# EAGLE design dawa_v4.0 (EAGLE 7.4.0)
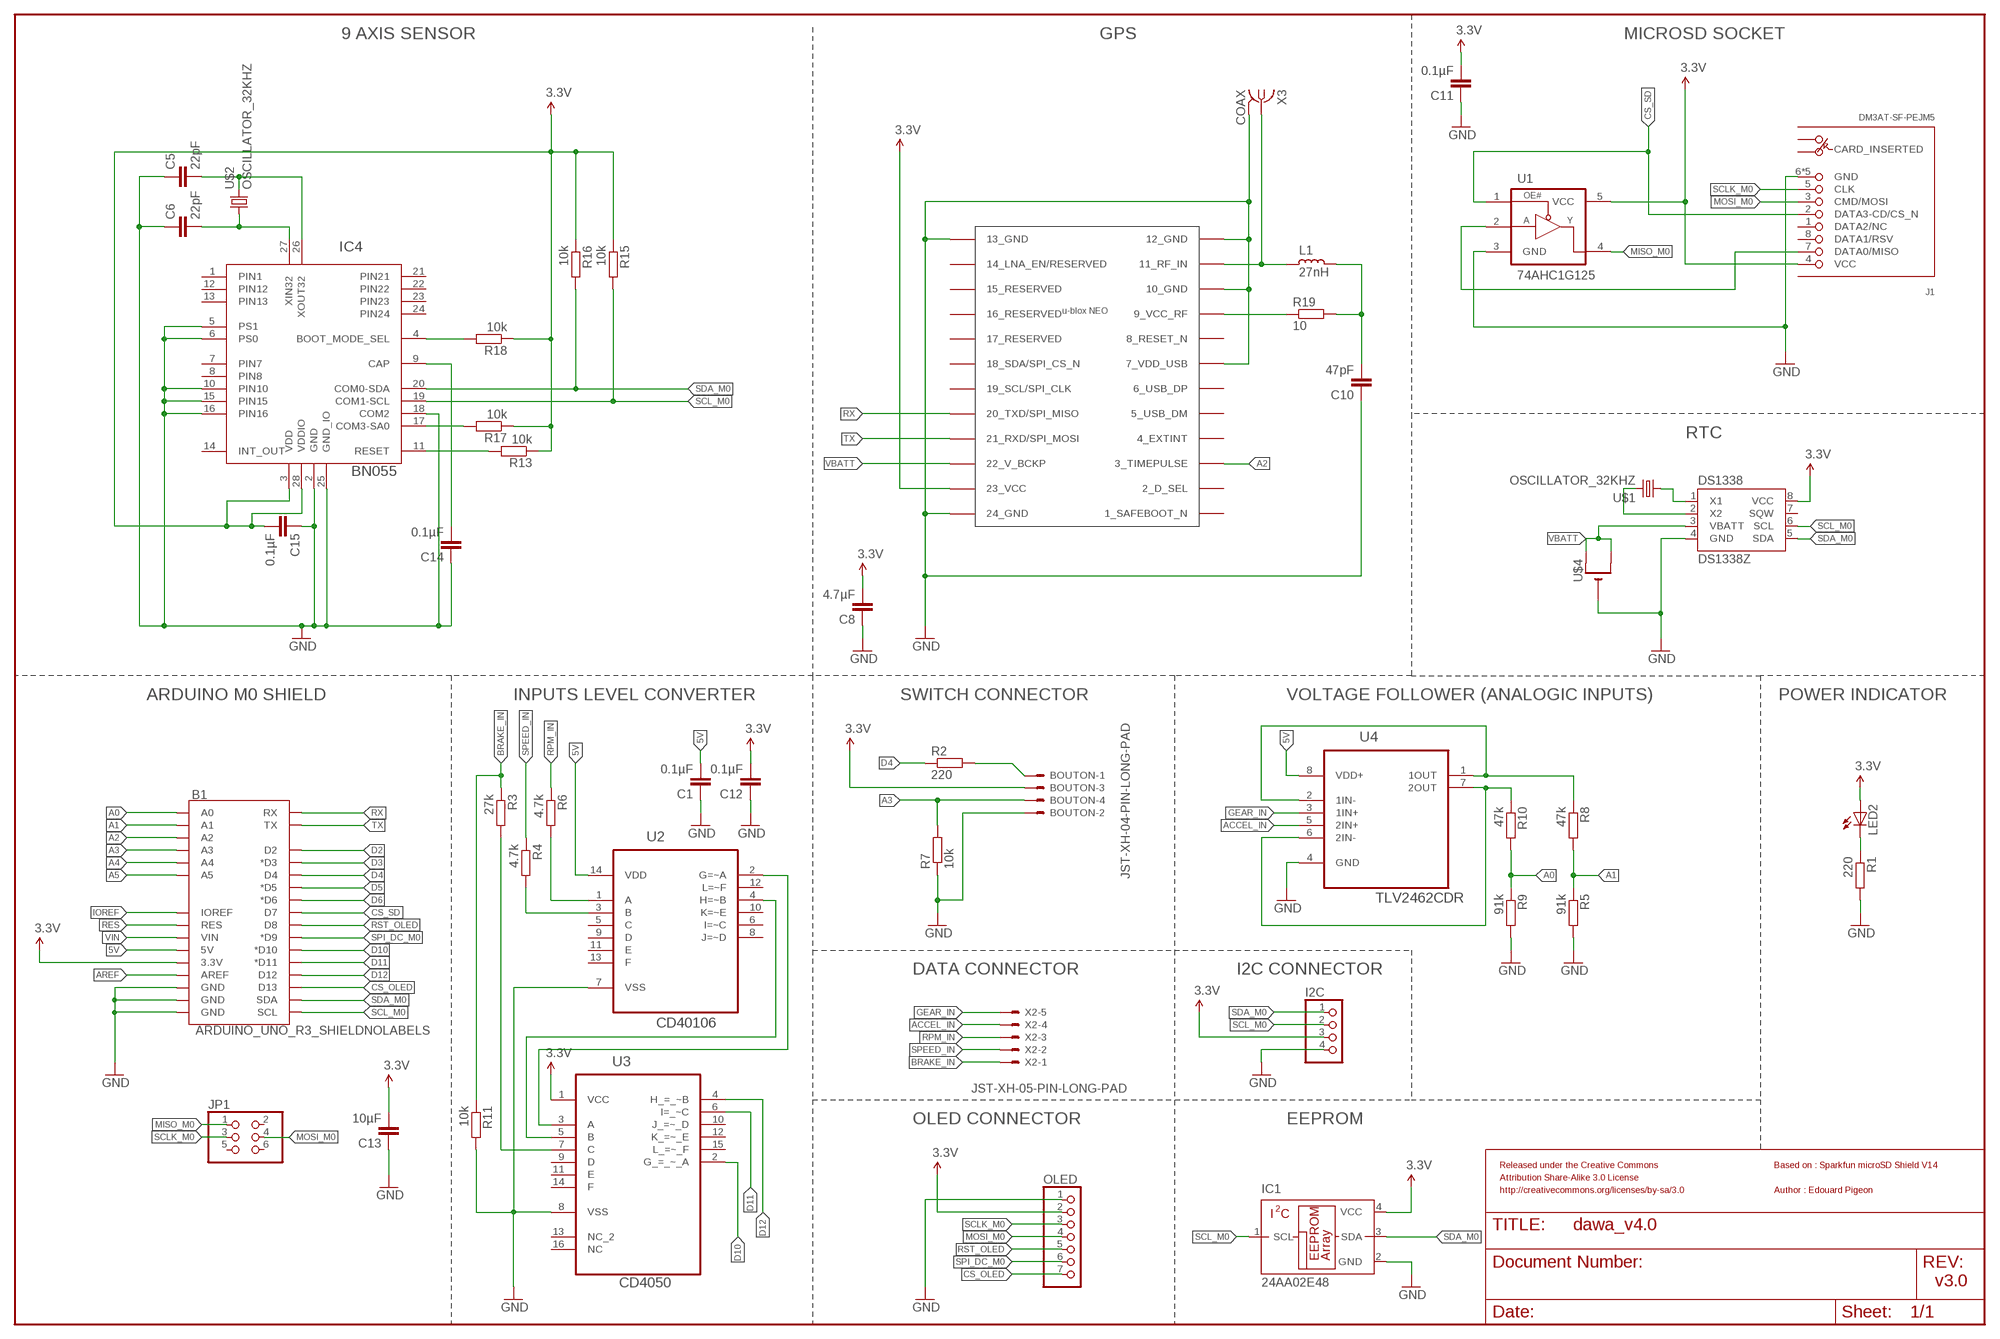
[diagram p0: schematic, sheet 1]

## Parts
B1  ARDUINO_UNO_R3_SHIELDNOLABELS  [UNO_R3_SHIELD_NOLABELS]
BOUTON  JST-XH-04-PIN-LONG-PAD  [JST-XH-04-PACKAGE-LONG-PAD]
C1  0.1µF  C-EUC0603  [C0603]
C5  22pF  C-EUC0603  [C0603]
C6  22pF  C-EUC0603  [C0603]
C8  4.7µF  C-EUC0603  [C0603]
C10  47pF  C-EUC0603  [C0603]
C11  0.1µF  C-EUC0603  [C0603]
C12  0.1µF  C-EUC0603  [C0603]
C13  10µF  C-EUC0603  [C0603]
C14  0.1µF  C-EUC0603  [C0603]
C15  0.1µF  C-EUC0603  [C0603]
DS1338  DS1338Z  [SO08]
I2C  PINHD-1X4  [1X04]
IC1  24AA02E48  24AA00OT  [SOT23-5L]
IC4  BN055  1658_BNO055  [LGA-28_3.80X5.20/0.5]
J1  DM3AT-SF-PEJM5  [DM3AT-SF-PEJM5]
JP1  PINHD-2X3  [2X03]
L1  27nH  L_0603  [L0603]
LED2  LEDCHIPLED_1206  [CHIPLED_1206]
OLED  PINHD-1X7  [1X07]
R1  220  R-EU_R0603  [R0603]
R2  220  R-EU_R0603  [R0603]
R3  27k  R-EU_R0603  [R0603]
R4  4.7k  R-EU_R0603  [R0603]
R5  91k  R-EU_R0603  [R0603]
R6  4.7k  R-EU_R0603  [R0603]
R7  10k  R-EU_R0603  [R0603]
R8  47k  R-EU_R0603  [R0603]
R9  91k  R-EU_R0603  [R0603]
R10  47k  R-EU_R0603  [R0603]
R11  10k  R-EU_R0603  [R0603]
R13  10k  R-EU_R0603  [R0603]
R15  10k  R-EU_R0603  [R0603]
R16  10k  R-EU_R0603  [R0603]
R17  10k  R-EU_R0603  [R0603]
R18  10k  R-EU_R0603  [R0603]
R19  10  R-EU_M1206  [M1206]
U1  74AHC1G125  74AHC1G125DBV  [SOT23-5]
U2  CD40106  CD40106BPW  [SOP65P640X120-14N]
U3  CD4050  CD4049UBPW  [SOP65P640X120-16N]
U4  TLV2462CDR  [SOIC127P600X175-8N]
U$1  OSCILLATOR_32KHZ  [OSCILLATOR_SMD]
U$2  OSCILLATOR_32KHZ  [OSCILLATOR_SMD]
U$3  NEO-M8  [NEO-M8]
U$4  CR1220SMT  [CR1220-SMD]
X2  JST-XH-05-PIN-LONG-PAD  [JST-XH-05-PACKAGE-LONG-PAD]
X3  COAX  [MMCX-J-P-X-ST-EM1-MKT]

## Nets
3.3V: B1.3.3V BOUTON.3 C8.2 C11.2 C12.2 C13.2 C15.2 DS1338.8(VCC) I2C.3 IC1.4(VCC) IC4.3(VDD) IC4.28(VDDIO) J1.4(VCC) LED2.A OLED.2 R13.1 R15.1 R16.1 R17.1 R18.1 U1.5(VCC) U3.1(VCC) U$3.23(23_VCC)
5V: B1.5V C1.2 U2.14(VDD) U4.8(VDD+)
A0: B1.A0 R9.1 R10.2
A1: B1.A1 R5.1 R8.2
A2: B1.A2 U$3.3(3_TIMEPULSE)
A3: B1.A3 BOUTON.4 R7.2
A4: B1.A4
A5: B1.A5
ACCEL_IN: U4.5(2IN+) X2.4
AREF: B1.AREF
BRAKE_IN: R3.1 R11.1 X2.1
CS_OLED: B1.D13 OLED.7
CS_SD: B1.D7 J1.2(DATA3-CD/CS_N) U1.1(OE#)
D2: B1.D2
D3: B1.D3(*D3)
D4: B1.D4 R2.1
D5: B1.D5(*D5)
D6: B1.D6(*D6)
D10: B1.D10(*D10) U3.2(G_=_~_A)
D11: B1.D11(*D11) U3.6(I=_~C)
D12: B1.D12 U3.4(H_=_~B)
GEAR_IN: U4.3(1IN+) X2.5
GND: B1.GND@0(GND) B1.GND@1(GND) B1.GND@2(GND) BOUTON.2 C1.1 C5.1 C6.1 C8.1 C10.1 C11.1 C12.1 C13.1 C14.1 C15.1 DS1338.4(GND) I2C.4 IC1.2(GND) IC4.2(GND) IC4.5(PS1) IC4.6(PS0) IC4.10(PIN10) IC4.15(PIN15) IC4.16(PIN16) IC4.18(COM2) IC4.25(GND_IO) J1.6(GND) J1.MOUNT0(GND) J1.MOUNT1(GND) J1.MOUNT2(GND) J1.MOUNT3(GND) OLED.1 R1.2 R5.2 R7.1 R9.2 R11.2 U1.3(GND) U2.7(VSS) U3.8(VSS) U4.4(GND) U$3.7(7_VDD_USB) U$3.10(10_GND) U$3.12(12_GND) U$3.13(13_GND) U$3.24(24_GND) U$4.- X3.2@1(GND)
IOREF: B1.IOREF
MISO_M0: JP1.1 U1.4(Y)
MOSI_M0: J1.3(CMD/MOSI) JP1.4 OLED.4
N$1: BOUTON.1 R2.2
N$2: R6.2 U2.1(A)
N$3: U2.2(G=~A) U3.3(A)
N$4: R4.2 U2.3(B)
N$5: R3.2 U3.7(C)
N$6: LED2.C R1.1
N$7: IC4.11(RESET) R13.2
N$8: DS1338.2(X2) U$1.2
N$9: DS1338.1(X1) U$1.1
N$10: J1.7(DATA0/MISO) U1.2(A)
N$11: C10.2 L1.1 R19.2
N$12: R8.1 U4.1(1OUT) U4.2(1IN-)
N$13: C14.2 IC4.9(CAP)
N$14: IC4.4(BOOT_MODE_SEL) R18.2
N$15: C5.2 IC4.26(XOUT32) U$2.2
N$16: C6.2 IC4.27(XIN32) U$2.1
N$17: IC4.17(COM3-SA0) R17.2
N$18: R10.1 U4.6(2IN-) U4.7(2OUT)
N$19: R19.1 U$3.9(9_VCC_RF)
N$20: L1.2 U$3.11(11_RF_IN) X3.1
N$21: U2.4(H=~B) U3.5(B)
RES: B1.RES
RPM_IN: R6.1 X2.3
RST_OLED: B1.D8 OLED.5
RX: B1.RX U$3.20(20_TXD/SPI_MISO)
SCL_M0: B1.SCL DS1338.6(SCL) I2C.2 IC1.1(SCL) IC4.19(COM1-SCL) R15.2
SCLK_M0: J1.5(CLK) JP1.3 OLED.3
SDA_M0: B1.SDA DS1338.5(SDA) I2C.1 IC1.3(SDA) IC4.20(COM0-SDA) R16.2
SPEED_IN: R4.1 X2.2
SPI_DC_M0: B1.D9(*D9) OLED.6
TX: B1.TX U$3.21(21_RXD/SPI_MOSI)
VBATT: DS1338.3(VBATT) U$3.22(22_V_BCKP) U$4.+$1(+) U$4.+$2(+1)
VIN: B1.VIN
Unconnected: DS1338.7(SQW) IC4.1(PIN1) IC4.7(PIN7) IC4.8(PIN8) IC4.12(PIN12) IC4.13(PIN13) IC4.14(INT_OUT) IC4.21(PIN21) IC4.22(PIN22) IC4.23(PIN23) IC4.24(PIN24) J1.1(DATA2/NC) J1.8(DATA1/RSV) J1.A J1.B JP1.2 JP1.5 JP1.6 U2.5(C) U2.6(I=~C) U2.8(J=~D) U2.9(D) U2.10(K=~E) U2.11(E) U2.12(L=~F) U2.13(F) U3.9(D) U3.10(J_=~_D) U3.11(E) U3.12(K_=~_E) U3.13(NC_2) U3.14(F) U3.15(L_=~_F) U3.16(NC) U$3.1(1_SAFEBOOT_N) U$3.2(2_D_SEL) U$3.4(4_EXTINT) U$3.5(5_USB_DM) U$3.6(6_USB_DP) U$3.8(8_RESET_N) U$3.14(14_LNA_EN/RESERVED) U$3.15(15_RESERVED) U$3.16(16_RESERVED) U$3.17(17_RESERVED) U$3.18(18_SDA/SPI_CS_N) U$3.19(19_SCL/SPI_CLK)

## Notes on the sheet
- 9 AXIS SENSOR | GPS | MICROSD SOCKET
- RTC
- ARDUINO M0 SHIELD | POWER INDICATOR
- INPUTS LEVEL CONVERTER | SWITCH CONNECTOR | VOLTAGE FOLLOWER (ANALOGIC INPUTS)
- DATA CONNECTOR | I2C CONNECTOR
- OLED CONNECTOR | EEPROM
- Released under the Creative Commons | Based on : Sparkfun microSD Shield V14
- Attribution Share-Alike 3.0 License
- http://creativecommons.org/licenses/by-sa/3.0 | Author : Edouard Pigeon
- v3.0

## Power pins joined to a net without a drawn wire
GND: X3.2@2(GND) X3.2@3(GND) X3.2@4(GND)

## Library data of the parts
B1 = SparkFun-Boards-resize:ARDUINO_UNO_R3_SHIELD: Arduino R3 Shield Footprint Shield form compatible with the Arduino Uno R3. SparkFun Products: MG2639 Cellular Shield <https://www.sparkfun.com/products/13120> MIDI Shield <https://www.sparkfun.com/products/12898> R3 Stackable Headers Kit <https://www.sparkfun.com/products/11417>
BOUTON = Rembrandt Electronics - JST XH Connectors v1-0:JST-XH-04-PIN: JST XH Connector 2 Pin Wire to board connector. Pitch: 2,54 mm, (0.100") Number of pins: 4 Created by Rembrandt Electronics www.rembrandtelectronics.com
C1 C5 C6 C8 C10-C15 = rcl:C-EU: CAPACITOR, European symbol
DS1338 = maxim-ic:DS1338
I2C = pinhead:PINHD-1X4: PIN HEADER
IC1 = microchip:24*00: Serial EEPROM 128 bit, I2C (AA = 1.8 V/LC = 2.5 V/C = 5.0 V); MF: MICROCHIP; MPN: 24AA00T-I/OTG; OC_FARNELL: 1331264; OC_NEWARK: 89H3038
IC4 = BNO055-2:1658_BNO055: BN055 Intelligent 9-axis absolute orientation sensor; PART_NUMBER: BNO055
J1 = connector-hirose:DM3AT-SF-PEJM5: CONN MICRO SD R/A PUSH-PUSH SMD; DIGIKEY: HR1964CT-ND
JP1 = pinhead:PINHD-2X3: PIN HEADER
L1 = rc-master-smd:L_: INDUCTOR
LED2 = led:LED: LED OSRAM: - CHIPLED LG R971, LG N971, LY N971, LG Q971, LY Q971, LO R971, LY R971 LH N974, LH R974 LS Q976, LO Q976, LY Q976 LO Q996 - Hyper CHIPLED LW Q18S LB Q993, LB Q99A, LB R99A - SideLED LS A670, LO A670, LY A670, LG A670, LP A670 LB A673, LV A673, LT A673, LW A673 LH A674 LY A675 LS A676, LA A676, LO A676, LY A676, LW A676 LS A679, LY A679, LG A679 - Hyper Micro SIDELED® LS Y876, LA Y876, LO Y876, LY Y876 LT Y87S - SmartLED LW L88C, LW L88S LB L89C, LB L89S, LG L890 LS L89K, LO L89K, LY L89K LS L896, LA L896, LO L896, LY L896 - TOPLED LS T670, LO T670, LY T670, LG T670, LP T670 LSG T670, LSP T670, LSY T670, LOP T670, LYG T670 LG T671, LOG T671, LSG T671 LB T673, LV T673, LT T673, LW T673 LH T674 LS T676, LA T676, LO T676, LY T676, LB T676, LH T676, LSB T676, LW T676 LB T67C, LV T67C, LT T67C, LS T67K, LO T67K, LY T67K, LW E67C LS E67B, LA E67B, LO E67B, LY E67B, LB E67C, LV E67C, LT E67C LW T67C LS T679, LY T679, LG T679 LS T770, LO T770, LY T770, LG T770, LP T770 LB T773, LV T773, LT T773, LW T773 LH T774 LS E675, LA E675, LY E675, LS T675 LS T776, LA T776, LO T776, LY T776, LB T776 LHGB T686 LT T68C, LB T68C - Hyper Mini TOPLED® LB M676 - Mini TOPLED Santana® LG M470 LS M47K, LO M47K, LY M47K Source: http://www.osram.convergy.de LUXEON: - LUMILED® LXK2-PW12-R00, LXK2-PW12-S00, LXK2-PW14-U00, LXK2-PW14-V00 LXK2-PM12-R00, LXK2-PM12-S00, LXK2-PM14-U00 LXK2-PE12-Q00, LXK2-PE12-R00, LXK2-PE12-S00, LXK2-PE14-T00, LXK2-PE14-U00 LXK2-PB12-K00, LXK2-PB12-L00, LXK2-PB12-M00, LXK2-PB14-N00, LXK2-PB14-P00, LXK2-PB14-Q00 LXK2-PR12-L00, LXK2-PR12-M00, LXK2-PR14-Q00, LXK2-PR14-R00 LXK2-PD12-Q00, LXK2-PD12-R00, LXK2-PD12-S00 LXK2-PH12-R00, LXK2-PH12-S00 LXK2-PL12-P00, LXK2-PL12-Q00, LXK2-PL12-R00 Source: www.luxeon.com KINGBRIGHT: KA-3528ASYC Source: www.kingbright.com
OLED = pinhead:PINHD-1X7: PIN HEADER
R1-R11 R13 R15-R19 = resistor:R-EU_: RESISTOR, European symbol
U1 = 74ah:74AHC1G125: TRI-STATE SINGLE BUSS BUFFER
U2 = TI:CD40106BPW: QUADRUPLE FET BUS SWITCH 2.5-V/3.3-V LOW-VOLTAGE BUS SWITCH WITH 5-V-TOLERANT LEVEL SHIFTER; MPN: CD40106BPW; OC_FARNELL: 1741145; OC_NEWARK: 34R6794; PACKAGE: TSSOP-14; SUPPLIER: Texas Instruments
U3 = TI:CD4049UBPW: CMOS Hex Buffer/Converters; MPN: CD4049UBPW; OC_FARNELL: 1740863; OC_NEWARK: 50R5061; PACKAGE: TSSOP-16; SUPPLIER: Texas Instruments
U4 = TI:TLV2462CDR: OPERATIONAL AMPLIFIERS; MPN: TLV2462CDR; OC_FARNELL: 1535737; OC_NEWARK: 73C9479; PACKAGE: SOIC-8; SUPPLIER: Texas Instruments
U$1 U$2 = kanflo:OSCILLATOR_32KHZ: CM7V-T1A Tuning Fork Crystal 32.768 kHz
U$3 = ubloxLib:NEO-M8: u-blox NEO GNSS module
U$4 = adafruit:CR1220: CR1216/CR1220/CR1225 12mm 3V lithium coin cell Great for battery packup. Both SMT and THM holders. Note the THM package has the ground pads on both sides of the PCB so that the masks are the same - this reduces the cost
X2 = Rembrandt Electronics - JST XH Connectors v1-0:JST-XH-05-PIN: JST XH Connector 2 Pin Wire to board connector. Pitch: 2,54 mm, (0.100") Number of pins: 5 Created by Rembrandt Electronics www.rembrandtelectronics.com
X3 = con-samtec:COAX: MMCX STRAIGHT, EDGE MOUNT JACK- 50 OHM Source: http://www.samtec.com/ftppub/cpdf/MMCX-J-P-X-ST-EM1-MKT.pdf; OC_FARNELL: unknown; OC_NEWARK: unknown

## Board
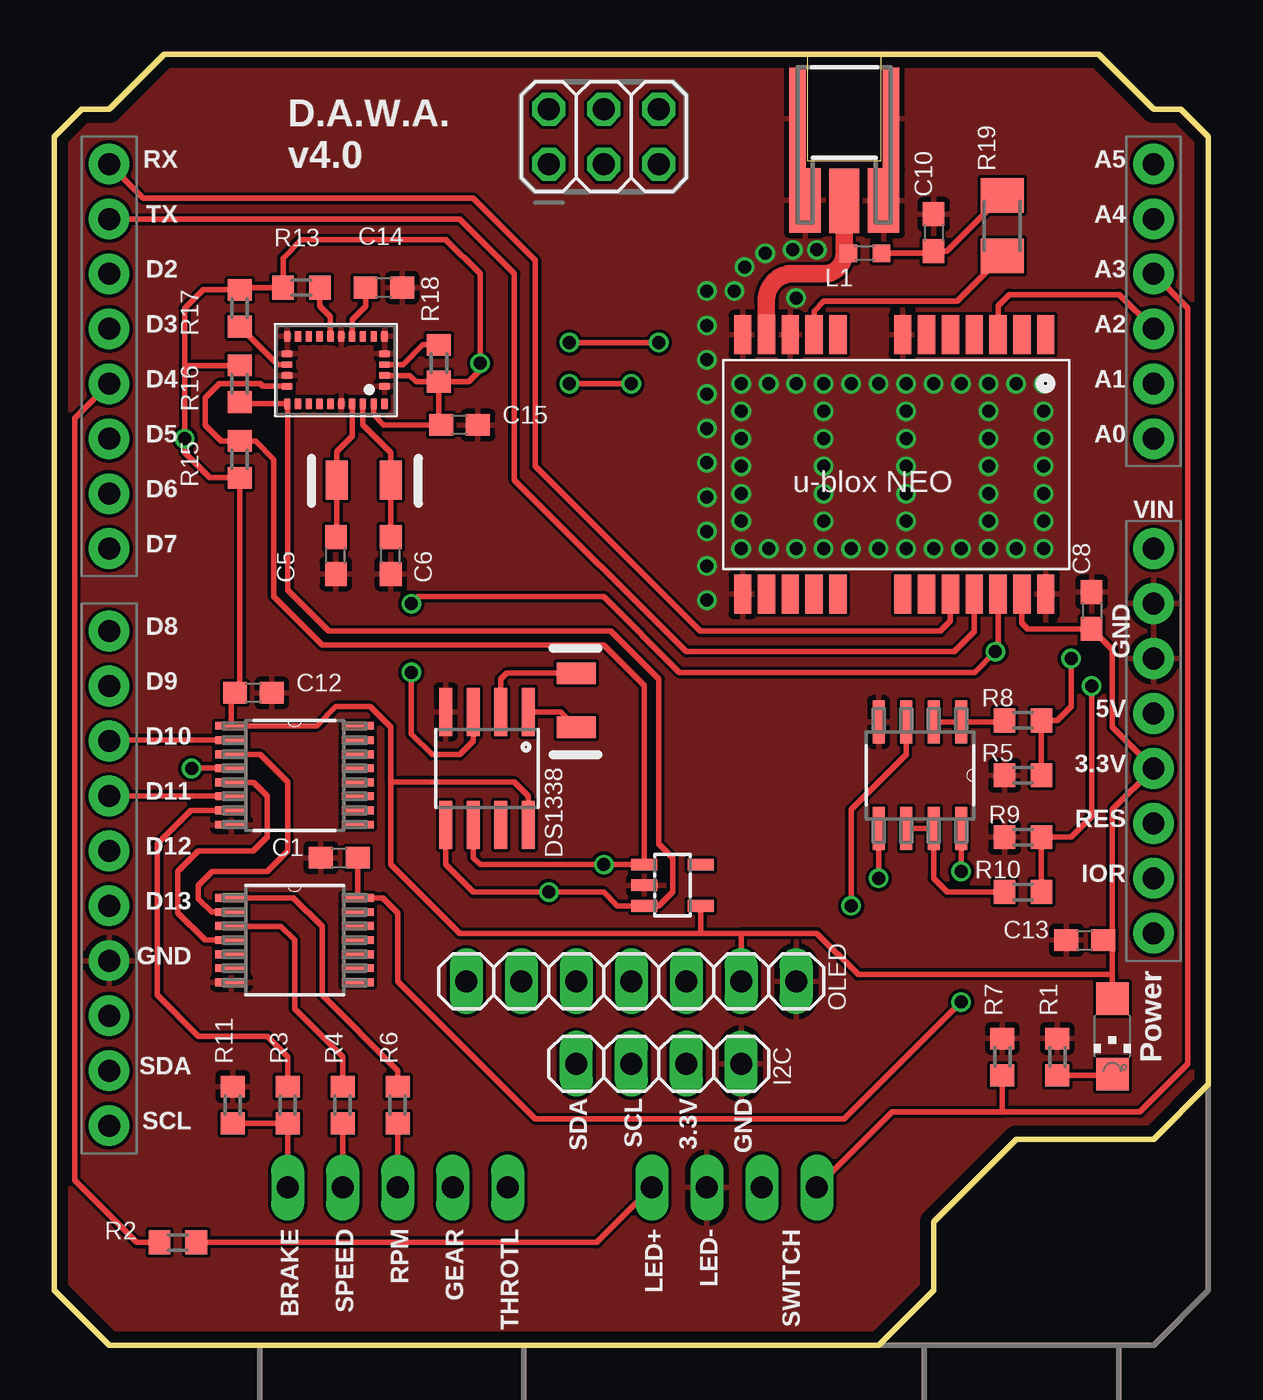
[diagram p1: board, top side]
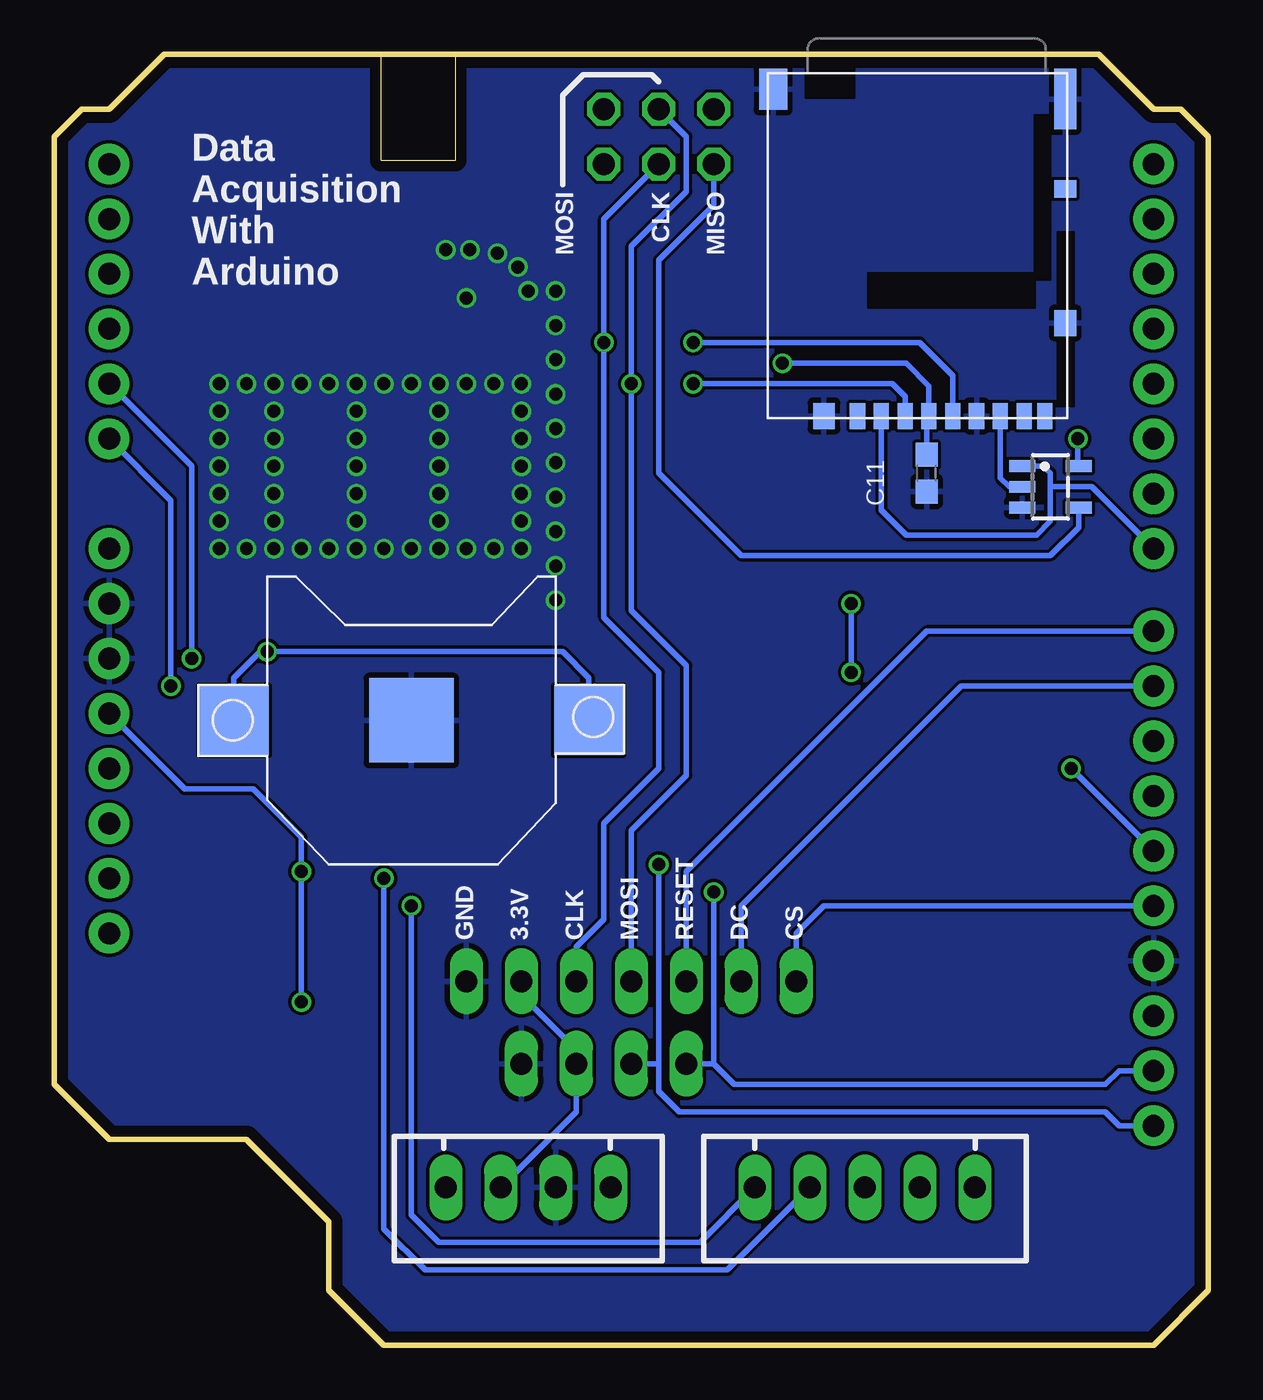
[diagram p2: board, bottom side, seen from below]

Size 53.34 x 59.69 mm. Coordinates in mm from the lower left corner, seen from the top.
Outline: 0,2.54 0,55.88 1.27,57.15 2.54,57.15 5.08,59.69 48.26,59.69 50.8,57.15 52.07,57.15 53.34,55.88 53.34,12.06 50.8,9.53 44.45,9.53 40.64,5.71 40.64,2.54 38.1,0 2.54,0 0,2.54
Copper layers (1*16): Top 0.035mm / dielectric 1.6mm / Bottom 0.035mm
Design rules "Elecrow_2-layer_PCB_eagle_rule": minimum track width 6mil, minimum drill 12mil, track to track 6mil, track to pad 6mil, pad to pad 6mil, via to via 8mil, smd to smd 0mil, copper to edge 20mil, drill to drill 10mil, minimum pad ring 6mil, minimum via ring 6mil, stop-mask expansion 0mil, vias tented up to drill 100mil, thermal gap 10mil

### Footprints (pad centres in the part's own frame; a part is rotated, then mirrored left to right if it is on the bottom)
UNO_R3_SHIELD_NOLABELS = drill 1.016 pad 1.88: 3.3V 24.13,-3.81; 5V 24.13,-1.27; A0 24.13,11.43; A1 24.13,13.97; A2 24.13,16.51; A3 24.13,19.05; A4 24.13,21.59; A5 24.13,24.13; AREF -24.13,-15.24; D2 -24.13,19.05; D3 -24.13,16.51; D4 -24.13,13.97; D5 -24.13,11.43; D6 -24.13,8.89; D7 -24.13,6.35; D8 -24.13,2.54; D9 -24.13,0; D10 -24.13,-2.54; D11 -24.13,-5.08; D12 -24.13,-7.62; D13 -24.13,-10.16; GND@0 24.13,1.27; GND@1 24.13,3.81; GND@2 -24.13,-12.7; IOREF 24.13,-8.89; NC 24.13,-11.43; RES 24.13,-6.35; RX -24.13,24.13; SCL -24.13,-20.32; SDA -24.13,-17.78; TX -24.13,21.59; VIN 24.13,6.35
JST-XH-04-PACKAGE-LONG-PAD = drill 1.016 long: 1 -3.81,0; 2 -1.27,0; 3 1.27,0; 4 3.81,0
C0603 = smd 1.1 x 1: 1 -0.85,0; 2 0.85,0
SO08 = smd 0.61 x 2.21: 1 -1.905,-2.616; 2 -0.635,-2.616; 3 0.635,-2.616; 4 1.905,-2.616; 5 1.905,2.616; 6 0.635,2.616; 7 -0.635,2.616; 8 -1.905,2.616
1X04 = drill 1.016 long: 1 -3.81,0; 2 -1.27,0; 3 1.27,0; 4 3.81,0
SOT23-5L = smd 0.55 x 1.2: 1 -0.95,-1.3; 2 0,-1.3; 3 0.95,-1.3; 4 0.95,1.3; 5 -0.95,1.3
LGA-28_3.80X5.20/0.5 = smd 0.3 x 0.5: 1 -2.25,1.56; 6 -2.25,-1.56; 7 -1.75,-1.56; 8 -1.25,-1.56; 9 -0.75,-1.56; 10 -0.25,-1.56; 11 0.25,-1.56; 12 0.75,-1.56; 13 1.25,-1.56; 14 1.75,-1.56; 15 2.25,-1.56; 20 2.25,1.56; 21 1.75,1.56; 22 1.25,1.56; 23 0.75,1.56; 24 0.25,1.56; 25 -0.25,1.56; 26 -0.75,1.56; 27 -1.25,1.56; 28 -1.75,1.56 | smd 0.5 x 0.3: 2 -2.25,0.75; 3 -2.25,0.25; 4 -2.25,-0.25; 5 -2.25,-0.75; 16 2.25,-0.75; 17 2.25,-0.25; 18 2.25,0.25; 19 2.25,0.75
DM3AT-SF-PEJM5 = smd 0.7 x 1.2: 1 3.2,-0.1; 2 2.1,-0.1; 3 1,-0.1; 4 -0.1,-0.1; 5 -1.2,-0.1; 6 -2.3,-0.1; 7 -3.4,-0.1; 8 -4.5,-0.1; B -5.45,-0.1 | smd 1 x 0.8: A -6.4,-10.6 | smd 1 x 1.2: MOUNT0 4.75,-0.1; MOUNT1 -6.4,-4.4 | smd 1 x 2.8: MOUNT2 -6.4,-14.75 | smd 1.3 x 1.9: MOUNT3 7.1,-15.2
2X03 = drill 1.016 octagon: 1 -2.54,-1.27; 2 -2.54,1.27; 3 0,-1.27; 4 0,1.27; 5 2.54,-1.27; 6 2.54,1.27
L0603 = smd 0.8 x 0.8: 1 -0.762,0; 2 0.762,0
CHIPLED_1206 = smd 1.5 x 1.5: A 0,-1.75; C 0,1.75
1X07 = drill 1.016 long: 1 -7.62,0; 2 -5.08,0; 3 -2.54,0; 4 0,0; 5 2.54,0; 6 5.08,0; 7 7.62,0
R0603 = smd 1 x 1.1: 1 -0.85,0; 2 0.85,0
M1206 = smd 1.6 x 2: 1 -1.4,0; 2 1.4,0
SOT23-5 = smd 0.55 x 1.2: 1 -0.95,-1.3; 2 0,-1.3; 3 0.95,-1.3; 4 0.95,1.3; 5 -0.95,1.3
SOP65P640X120-14N = smd 1.473 x 0.356: 1 -2.921,1.956; 2 -2.921,1.295; 3 -2.921,0.66; 4 -2.921,0; 5 -2.921,-0.66; 6 -2.921,-1.295; 7 -2.921,-1.956; 8 2.921,-1.956; 9 2.921,-1.295; 10 2.921,-0.66; 11 2.921,0; 12 2.921,0.66; 13 2.921,1.295; 14 2.921,1.956
SOP65P640X120-16N = smd 1.473 x 0.356: 1 -2.921,2.286; 2 -2.921,1.626; 3 -2.921,0.965; 4 -2.921,0.33; 5 -2.921,-0.33; 6 -2.921,-0.965; 7 -2.921,-1.626; 8 -2.921,-2.286; 9 2.921,-2.286; 10 2.921,-1.626; 11 2.921,-0.965; 12 2.921,-0.33; 13 2.921,0.33; 14 2.921,0.965; 15 2.921,1.626; 16 2.921,2.286
SOIC127P600X175-8N = smd 1.981 x 0.559: 1 -2.464,1.905; 2 -2.464,0.635; 3 -2.464,-0.635; 4 -2.464,-1.905; 5 2.464,-1.905; 6 2.464,-0.635; 7 2.464,0.635; 8 2.464,1.905
OSCILLATOR_SMD = smd 1 x 1.8: 1 0,0; 2 2.5,0
NEO-M8 = smd 1.8 x 0.8: 1 6.4,-7.4; 2 6.4,-6.3; 3 6.4,-5.2; 4 6.4,-4.1; 5 6.4,-3; 6 6.4,-1.9; 7 6.4,-0.8; 8 6.4,2.2; 9 6.4,3.3; 10 6.4,4.4; 11 6.4,5.5; 12 6.4,6.6; 13 -5.6,6.6; 14 -5.6,5.5; 15 -5.6,4.4; 16 -5.6,3.3; 17 -5.6,2.2; 18 -5.6,-0.8; 19 -5.6,-1.9; 20 -5.6,-3; 21 -5.6,-4.1; 22 -5.6,-5.2; 23 -5.6,-6.3; 24 -5.6,-7.4
CR1220-SMD = smd 3.2 x 3.2: +$1 -8.2,0; +$2 8.2,0 | smd 3.9 x 3.9: - 0,0
JST-XH-05-PACKAGE-LONG-PAD = drill 1.016 long: 1 -5.08,0; 2 -2.54,0; 3 0,0; 4 2.54,0; 5 5.08,0
MMCX-J-P-X-ST-EM1-MKT = smd 1.4 x 2.975: 1 0,-6.15 | smd 1.46 x 2.975: 2@1 -1.812,-6.125; 2@2 1.812,-6.138 | smd 0.76 x 4.7: 2@3 -2.163,-2.35; 2@4 2.163,-2.35

### Placement (x,y rotation side)
B1  26.67,30.48 0 top
BOUTON  31.43,7.3 180 bottom
C1  13.18,22.54 0 top
C5  13.02,36.51 90 top
C6  15.56,36.51 90 top
C8  47.94,33.97 270 top
C10  40.64,51.44 270 top
C11  13.02,40.32 90 bottom
C12  9.21,30.16 180 top
C13  47.62,18.73 0 top
C14  15.24,48.9 180 top
C15  18.73,42.55 180 top
DS1338  20,26.67 180 top
I2C  27.94,13.02 0 top
IC1  28.57,21.27 270 top
IC4  13.02,45.09 180 top
J1  13.02,42.86 180 bottom
JP1  25.4,55.88 0 top
L1  37.47,50.48 180 top
LED2  48.9,14.29 180 top
OLED  26.67,16.83 180 top
R1  46.36,13.34 90 top
R2  5.71,4.76 0 top
R3  10.79,11.11 90 top
R4  13.33,11.11 90 top
R5  44.77,26.35 180 top
R6  15.88,11.11 90 top
R7  43.82,13.34 270 top
R8  44.77,28.89 0 top
R9  44.77,23.5 180 top
R10  44.77,20.95 0 top
R11  8.26,11.11 90 top
R13  11.43,48.9 0 top
R15  8.57,40.96 90 top
R16  8.57,44.45 270 top
R17  8.57,47.94 270 top
R18  17.78,45.4 90 top
R19  43.82,51.75 90 top
U1  7.3,39.69 270 bottom
U2  11.11,18.73 0 top
U3  11.11,26.35 0 top
U4  40.01,26.35 270 top
U$1  24.13,28.57 90 top
U$2  15.56,40.01 180 top
U$3  38.42,40.32 90 top
U$4  36.83,28.89 0 bottom
X2  15.88,7.3 180 bottom
X3  36.51,59.05 0 top

### Tracks (layer width: path | path; a pad name or v marks a point on that pad's centre or on a via)
3.3V  (via drill 0.6)
  Top 0.254: 48.9,17.14 48.9,18.73 | 48.9,18.73 48.9,24.77 B1.3.3V 48.9,28.57 48.9,32.17 C8.2 44.98,33.12 44.72,33.39 U$3.23 | DS1338.8 21.91,25.4 21.27,26.04 15.56,26.04 | 15.56,26.04 15.56,22.23 18.73,19.05 29.84,19.05 | 29.84,19.05 31.75,19.05 | 15.56,26.04 15.56,28.57 14.61,29.53 13.02,29.53 12.13,28.64 U3.1 8.19,30 C12.2 8.57,30.38 R15.1 7.2,40.11 6.03,41.27 v6.03,41.91 6.03,45.3 | OLED.2 31.75,19.05 | IC1.4 29.88,19.08 29.84,19.05 | 6.03,45.3 6.03,47.94 6.88,48.79 R17.1 8.99,48.9 R13.1 10.58,50.27 11.43,51.12 18.1,51.12 19.68,49.53 v19.68,45.4 19.68,45.09 19.15,44.55 R18.1 | R16.1 6.03,45.3 | IC4.3 16.44,44.84 16.73,44.55 R18.1 | IC4.28 14.77,43.02 15.24,42.55 C15.2 17.78,42.65 R18.1 | LED2.A 48.9,17.14 | 48.9,17.14 37.15,17.14 35.24,19.05 31.75,19.05 | C13.2 48.9,18.73
  Bottom 0.254: v19.68,45.4 13.97,45.4 12.92,44.35 J1.4 13.02,42.86 C11.2 | OLED.2 31.75,16.19 29.21,13.65 I2C.3 29.21,10.79 BOUTON.3 | U1.5 6.03,40.67 v6.03,41.91
5V  (via drill 0.6)
  Top 0.254: v41.91,15.88 36.51,10.48 22.22,10.48 15.88,16.83 15.88,20 15.19,20.69 U2.14 C1.2 | U4.8 v41.91,21.91
  Bottom 0.254: v41.91,15.88 v41.91,21.91 41.91,23.5 44.13,25.72 47.31,25.72 B1.5V
A0  (via drill 0.6)
  Top 0.254: R10.2 R9.1 46.99,23.5 47.94,24.45 v47.94,30.48
  Bottom 0.254: v47.94,30.48 47.94,39.05 B1.A0
A1  (via drill 0.6)
  Top 0.254: R5.1 R8.2 46.36,28.89 46.99,29.53 v46.99,31.75
  Bottom 0.254: v46.99,31.75 46.99,40.64 B1.A1
A2
  Top 0.254: U$3.3 43.62,48.06 44.13,48.58 49.21,48.58 B1.A2
A3
  Top 0.254: 43.82,10.79 50.17,10.79 52.39,13.02 52.39,47.94 B1.A3 | R7.2 43.82,10.79 | 43.82,10.79 38.74,10.79 BOUTON.4
ACCEL_IN  (via drill 0.6)
  Top 0.254: U4.5 v38.1,21.59
  Bottom 0.254: v38.1,21.59 38.1,5.4 36.2,3.49 22.22,3.49 X2.4
BRAKE_IN
  Top 0.254: X2.1 R3.1 R11.1
CS_OLED
  Bottom 0.254: OLED.7 19.05,19.05 17.78,20.32 B1.D13
CS_SD
  Bottom 0.254: 7.3,39.69 5.4,39.69 B1.D7 | J1.2 15.12,38.61 13.97,37.47 7.94,37.47 7.3,38.1 7.3,39.69 | U1.1 7.62,40.64 7.3,40.32 7.3,39.69
D4
  Top 0.254: B1.D4 0.95,42.86 0.95,7.62 3.81,4.76 R2.1
D10
  Top 0.254: U3.2 2.58,27.98 B1.D10
D11
  Top 0.254: U3.6 2.55,25.39 B1.D11
D12  (via drill 0.6)
  Top 0.254: U3.4 6.36,26.68 v6.35,26.67
  Bottom 0.254: B1.D12 v6.35,26.67
GEAR_IN  (via drill 0.6)
  Top 0.254: v36.83,20.32 36.83,24.77 39.37,27.3 U4.3
  Bottom 0.254: v36.83,20.32 36.83,6.03 35.56,4.76 23.5,4.76 X2.5
GND  (via drill 0.6)
  other vias: 34.13,50.64 31.75,44.45 31.75,43.18 31.75,41.91 31.75,40.64 31.75,39.37 31.75,38.1 31.75,36.83 33.02,36.83 34.29,36.83 35.56,36.83 36.83,36.83 38.1,36.83 33.02,44.45 34.29,44.45 35.56,44.45 36.83,44.45 38.1,44.45 39.37,44.45 40.64,44.45 41.91,44.45 39.37,36.83 40.64,36.83 41.91,36.83 43.18,36.83 44.45,36.83 45.72,36.83 45.72,38.1 45.72,39.37 45.72,40.64 45.72,44.45 45.72,43.18 44.45,44.45 35.56,43.18 39.37,43.18 43.18,41.91 43.18,40.64 43.18,39.37 43.18,38.1 39.37,41.91 39.37,40.64 39.37,39.37 39.37,38.1 35.56,41.91 35.56,40.64 35.56,39.37 35.56,38.1 43.18,43.18 43.18,44.45 45.72,41.91 32.86,50.48 34.29,48.42 35.24,50.64 30.16,47.15 30.16,45.56 30.16,43.97 30.16,42.39 30.16,40.8 30.16,39.21 30.16,37.62 30.16,36.04 30.16,34.45 30.16,48.74 31.43,48.74 31.91,49.85
  pour Bottom: 2.54,0 0,2.54 0,55.88 1.27,57.15 2.54,57.15 5.08,59.69 48.26,59.69 50.8,57.15 52.07,57.15 53.34,55.88 53.34,12.06 50.8,9.53 44.45,9.53 40.64,5.71 40.64,2.54 38.1,0
  pour Top: 2.54,0 0,2.54 0,55.88 1.27,57.15 2.54,57.15 5.08,59.69 48.26,59.69 50.8,57.15 52.07,57.15 53.34,55.88 53.34,12.06 50.8,9.53 44.45,9.53 40.64,5.71 40.64,2.54 38.1,0
MISO_M0
  Bottom 0.254: JP1.1 22.86,52.7 25.4,50.16 25.4,40.32 21.59,36.51 7.3,36.51 6,37.81 U1.4
MOSI_M0  (via drill 0.6)
  Top 0.254: v23.81,44.45 v26.67,44.45
  Bottom 0.254: OLED.4 26.67,23.81 24.13,26.35 24.13,31.43 26.67,33.97 v26.67,44.45 26.67,50.8 24.13,53.34 24.13,55.88 JP1.4 | J1.3 14.02,43.86 14.61,44.45 v23.81,44.45
N$1
  Top 0.254: BOUTON.1 25.08,4.76 R2.2
N$2
  Top 0.254: R6.2 15.88,12.7 12.38,16.19 12.38,19.37 11.06,20.69 U2.1
N$3
  Top 0.254: U2.2 7.28,20.03 6.67,20.64 6.67,21.27 7.3,21.91 9.84,21.91 10.79,22.86 10.79,26.04 9.53,27.3 7.89,27.3 U3.3
N$4
  Top 0.254: R4.2 13.33,13.34 11.11,15.56 11.11,18.73 10.48,19.37 8.22,19.37 U2.3
N$5
  Top 0.254: U3.7 6.31,24.73 4.76,23.18 4.76,16.19 6.67,14.29 9.84,14.29 10.79,13.34 R3.2
N$6
  Top 0.254: LED2.C 48.84,12.48 R1.1
N$7
  Top 0.254: IC4.11 12.77,47.56 12.28,48.05 R13.2
N$8
  Top 0.254: U$1.2 20.91,31.07 20.64,30.8 DS1338.2
N$9
  Top 0.254: DS1338.1 23.42,29.29 U$1.1
N$10
  Bottom 0.254: J1.7 9.62,40.1 9.21,39.69 U1.2
N$11
  Top 0.254: L1.1 40.54,50.48 C10.2 41.25,50.59 R19.2
N$12
  Top 0.254: 44.18,28.95 R8.1 43.84,28.82 U4.1 U4.2
N$13
  Top 0.254: IC4.9 13.77,47.42 14.39,48.05 C14.2
N$14
  Top 0.254: IC4.4 16.12,45.34 17.04,46.25 R18.2
N$15
  Top 0.254: IC4.26 13.77,42.02 13.06,41.31 U$2.2 13.06,37.4 C5.2
N$16
  Top 0.254: IC4.27 14.27,42.56 15.56,41.27 U$2.1 C6.2
N$17
  Top 0.254: IC4.17 10.33,45.34 R17.2
N$18
  Top 0.254: R10.1 41.28,20.95 40.64,21.59 U4.7 U4.6
N$19
  Top 0.254: U$3.9 35.12,47.82 35.56,48.26 41.72,48.26 R19.1
N$20
  Top 0.254: U$3.11 33.21,46.72 | L1.2 36.51,50.48
  Top 0.813: U$3.11 32.92,48.16 arc-90 33.97,49.53 35.56,49.53 arc90 36.51,50.48 X3.1
N$21
  Top 0.254: U3.5 9.22,26.02 9.84,25.4 9.84,23.5 9.21,22.86 6.67,22.86 5.71,21.91 5.71,20 6.98,18.73 U2.4
RPM_IN
  Top 0.254: X2.3 R6.1
RST_OLED
  Bottom 0.254: OLED.5 24.13,21.91 13.02,33.02 B1.D8
RX
  Top 0.254: U$3.20 41.42,33.48 40.96,33.02 29.84,33.02 22.22,40.64 22.22,50.16 19.37,53.02 4.13,53.02 B1.RX
SCL_M0  (via drill 0.6)
  Top 0.254: DS1338.6 19.37,22.54 19.69,22.22 v25.4,22.22 | IC1.1 v25.4,22.22 | v25.4,22.22 v25.4,22.23 | IC1.1 | IC4.19 9.64,44.34 9.53,44.45 7.62,44.45 6.98,43.81 6.98,42.55 7.72,41.81 R15.2 9.31,41.81 10.16,40.96 10.16,34.61 12.38,32.38 25.4,32.38 27.27,30.51 IC1.1
  Bottom 0.254: v25.4,22.23 25.4,13.02 | 25.4,13.02 25.4,11.75 24.45,10.79 4.76,10.79 4.13,10.16 B1.SCL | I2C.2 25.4,13.02
SCLK_M0  (via drill 0.6)
  Top 0.254: v23.81,46.35 v27.94,46.35
  Bottom 0.254: OLED.3 29.21,18.41 27.94,19.68 27.94,24.13 25.4,26.67 25.4,31.11 27.94,33.66 v27.94,46.35 27.94,52.07 JP1.3 | J1.5 11.82,44.84 13.33,46.35 v23.81,46.35
SDA_M0  (via drill 0.6)
  Top 0.254: DS1338.5 18.1,22.23 19.37,20.95 v22.86,20.95 25.4,20.95 26.03,20.32 IC1.3 27.94,20.32 28.57,20.95 28.57,22.54 27.94,23.18 27.94,30.8 25.72,33.02 12.7,33.02 10.79,34.92 10.79,43.5 IC4.20 8.65,43.52 R16.2
  Bottom 0.254: 22.86,13.02 v22.86,20.95 | 22.86,13.02 21.91,12.06 4.76,12.06 4.13,12.7 B1.SDA | I2C.1 22.86,13.02
SPEED_IN
  Top 0.254: X2.2 R4.1
SPI_DC_M0
  Bottom 0.254: OLED.6 21.59,20.32 11.43,30.48 B1.D9
TX
  Top 0.254: U$3.21 42.52,32.99 41.59,32.07 29.21,32.07 21.27,40.01 21.27,49.53 18.73,52.07 B1.TX
VBATT  (via drill 0.6)
  Top 0.254: v16.51,34.29 16.83,34.61 25.4,34.61 28.89,31.11 42.55,31.11 v43.5,32.07 43.62,32.19 U$3.22 | DS1338.3 19.37,27.94 18.73,27.3 17.46,27.3 16.51,28.26 v16.51,31.11
  Bottom 0.254: v16.51,31.11 v16.51,34.29 | U$4.+$2 28.63,30.85 29.84,32.07 v43.5,32.07 43.82,32.07 45.03,30.85 U$4.+$1

### Text on the board
tPlace: RX | A5 | D.A.W.A. / v4.0 | TX | A4 | D2 | A3 | D3 | A2 | D4 | A1 | D5 | A0 | D6 | VIN | D7 | D8 | GND | D9 | 5V | D10 | 3.3V | D11 | RES | D12 | IOR | D13 | GND | SDA | Power | SCL | SDA | SCL | 3.3V | GND | BRAKE | SPEED | RPM | GEAR | THROTL | LED+ | LED- | SWITCH
bPlace: MISO | CLK | MOSI | Data / Acquisition / With / Arduino | CS | DC | RESET | MOSI | CLK | 3.3V | GND